# EAGLE design dual uln plane (EAGLE 5.10)
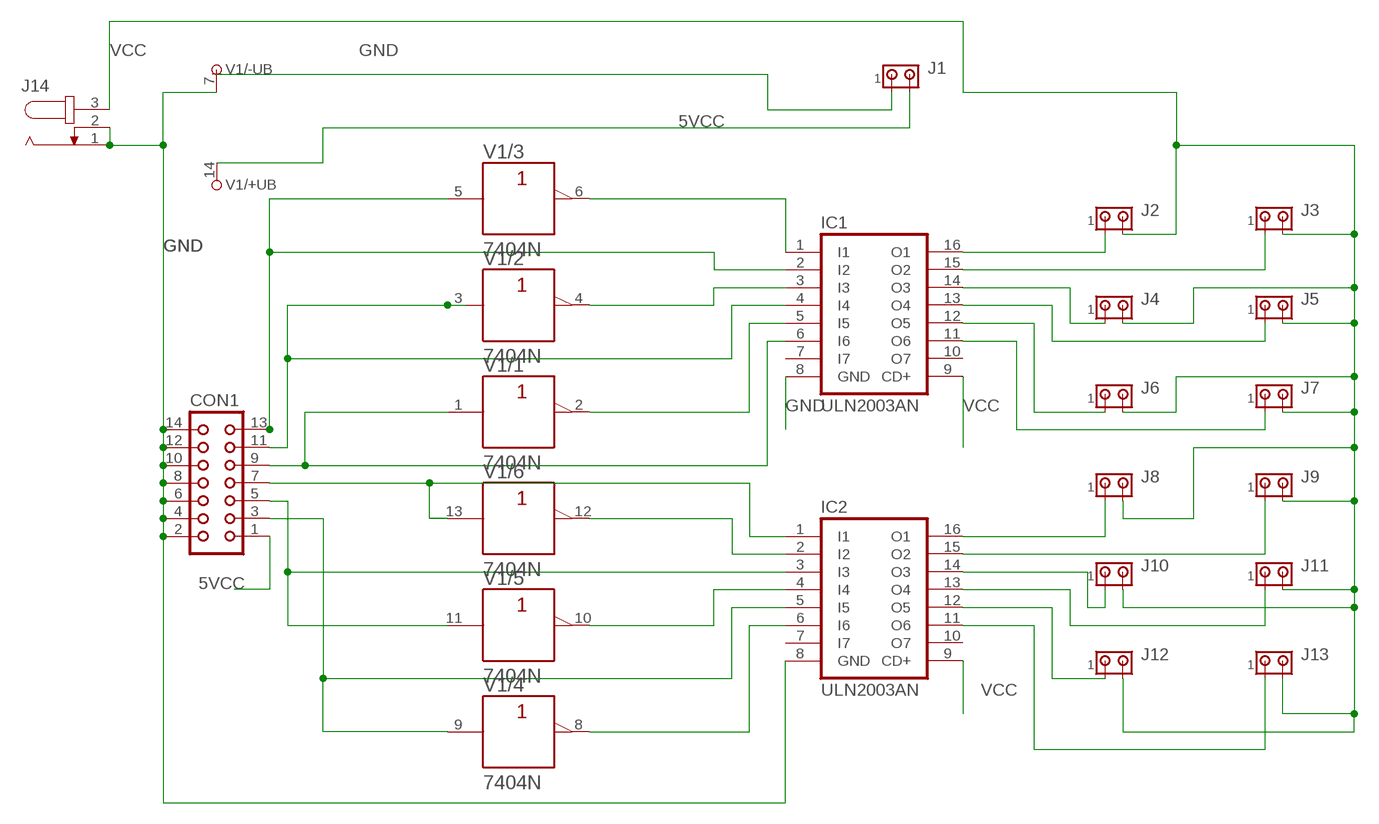
[diagram p0: schematic, sheet 1]

## Parts
CON1  CON14  [CON14]
IC1  ULN2003AN  [DIL16]
IC2  ULN2003AN  [DIL16]
J1  MTA02-100  [10X02MTA]
J2  MTA02-100  [10X02MTA]
J3  MTA02-100  [10X02MTA]
J4  MTA02-100  [10X02MTA]
J5  MTA02-100  [10X02MTA]
J6  MTA02-100  [10X02MTA]
J7  MTA02-100  [10X02MTA]
J8  MTA02-100  [10X02MTA]
J9  MTA02-100  [10X02MTA]
J10  MTA02-100  [10X02MTA]
J11  MTA02-100  [10X02MTA]
J12  MTA02-100  [10X02MTA]
J13  MTA02-100  [10X02MTA]
J14  JACK-PLUG1  [SPC4078]
V1  7404N  [DIL14]

## Nets
5VCC: CON1.1 J1.2 V1.14(/+UB:+UB)
GND: CON1.2 CON1.4 CON1.6 CON1.8 CON1.10 CON1.12 CON1.14 IC1.8(GND) IC2.8(GND) J1.1 J14.1 J14.2 V1.7(/-UB:-UB)
N$1: IC1.3(I3) V1.4(/2:Y)
N$2: IC1.5(I5) V1.2(/1:Y)
N$3: CON1.13 IC1.2(I2) V1.5(/3:A)
N$4: CON1.7 IC2.1(I1) V1.13(/6:A)
N$5: CON1.11 IC1.4(I4) V1.3(/2:A)
N$6: IC1.1(I1) V1.6(/3:Y)
N$7: CON1.9 IC1.6(I6) V1.1(/1:A)
N$9: CON1.5 IC2.3(I3) V1.11(/5:A)
N$10: CON1.3 IC2.5(I5) V1.9(/4:A)
N$12: IC2.2(I2) V1.12(/6:Y)
N$13: IC2.4(I4) V1.10(/5:Y)
N$14: IC2.6(I6) V1.8(/4:Y)
N$15: IC1.16(O1) J2.1
N$16: IC1.15(O2) J3.1
N$17: IC1.14(O3) J4.1
N$18: IC1.13(O4) J5.1
N$19: IC1.12(O5) J6.1
N$20: IC1.11(O6) J7.1
N$21: IC2.16(O1) J8.1
N$22: IC2.15(O2) J9.1
N$23: IC2.14(O3) J10.1
N$24: IC2.13(O4) J11.1
N$25: IC2.12(O5) J12.1
N$26: IC2.11(O6) J13.1
VCC: IC1.9(CD+) IC2.9(CD+) J2.2 J3.2 J4.2 J5.2 J6.2 J7.2 J8.2 J9.2 J10.2 J11.2 J12.2 J13.2 J14.3
Unconnected: IC1.7(I7) IC1.10(O7) IC2.7(I7) IC2.10(O7)

## Library data of the parts
CON1 = con-harting:CON14: CONNECTOR
IC1 IC2 = uln-udn:ULN2003A: DRIVER ARRAY
J1-J13 = con-amp:MTA02-100: AMP connector
J14 = con-jack:JACK-PLUG: DC POWER JACK Power Jack, DC, Right Angle, Through Hole, Rated 5A at 16VDC, PC Terminals Distributor: Farnell (www.Farnell.de) Drawing: 84N1161.pdf / 84N1162.pdf Manufacturer: SPC Technology (www.spctechnology.com) Type: SPC4077 / SPC 4078
V1 = 74ttl-din:74*04: Hex INVERTER

## Board
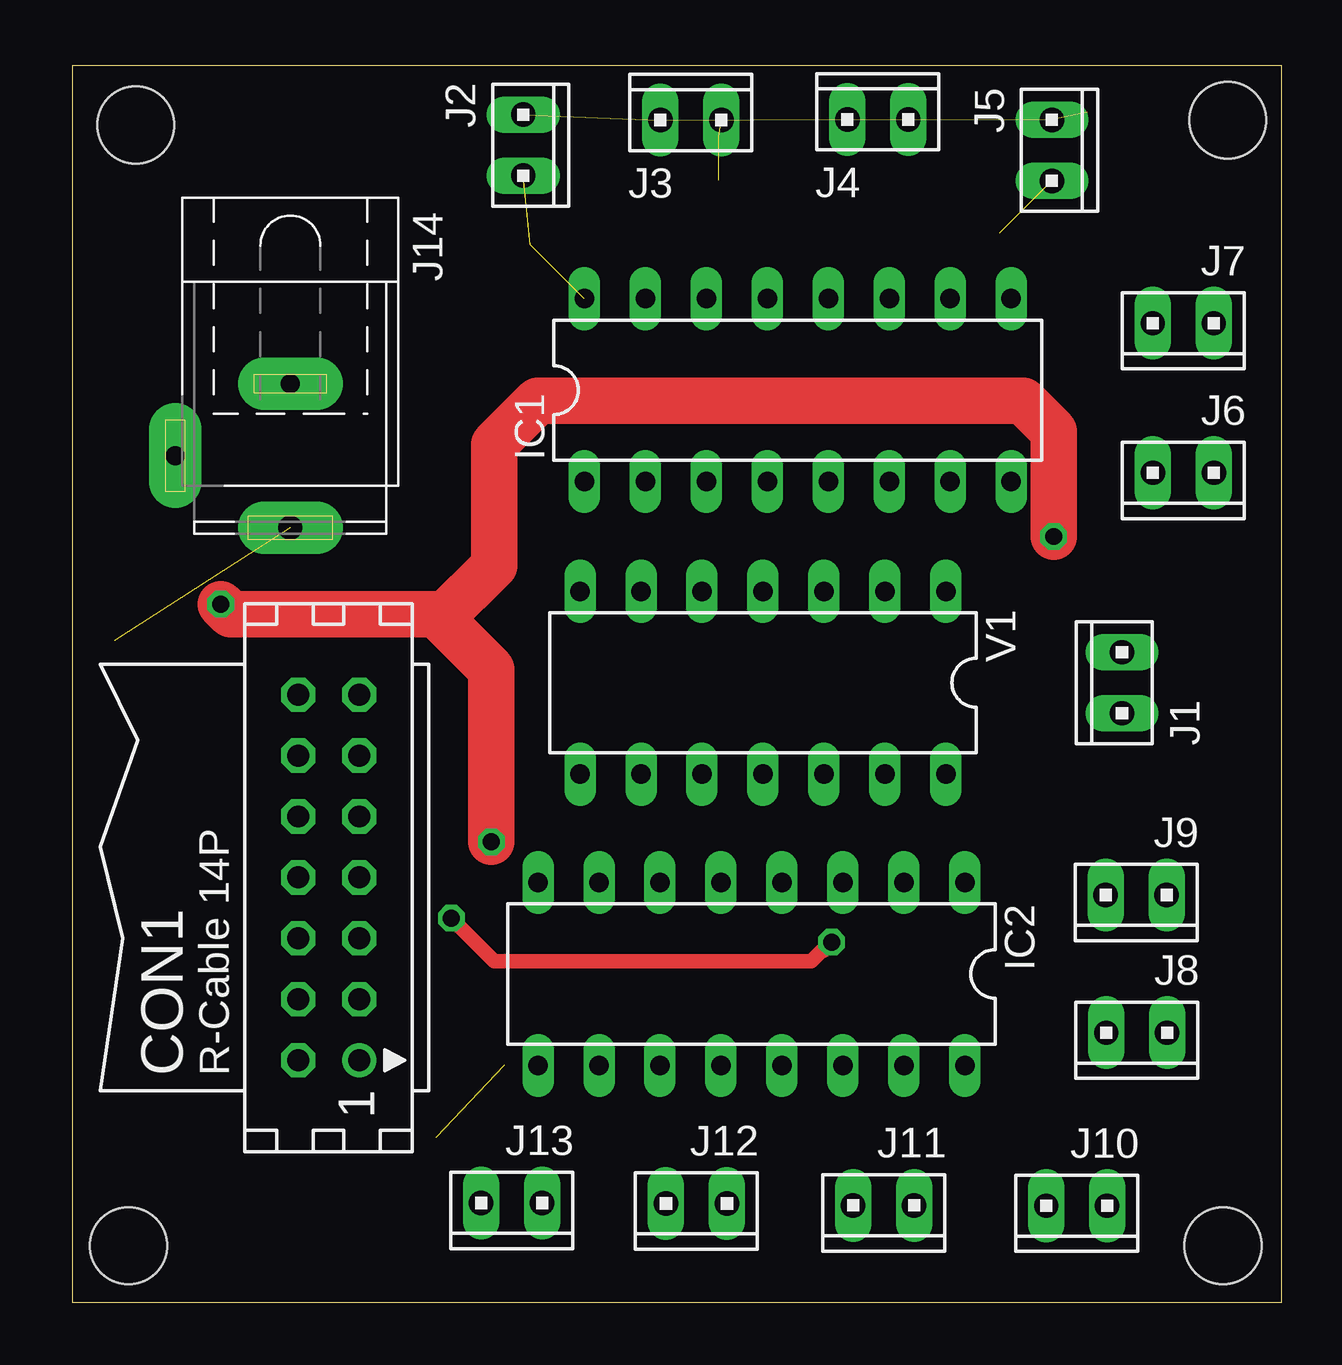
[diagram p1: board, top side]
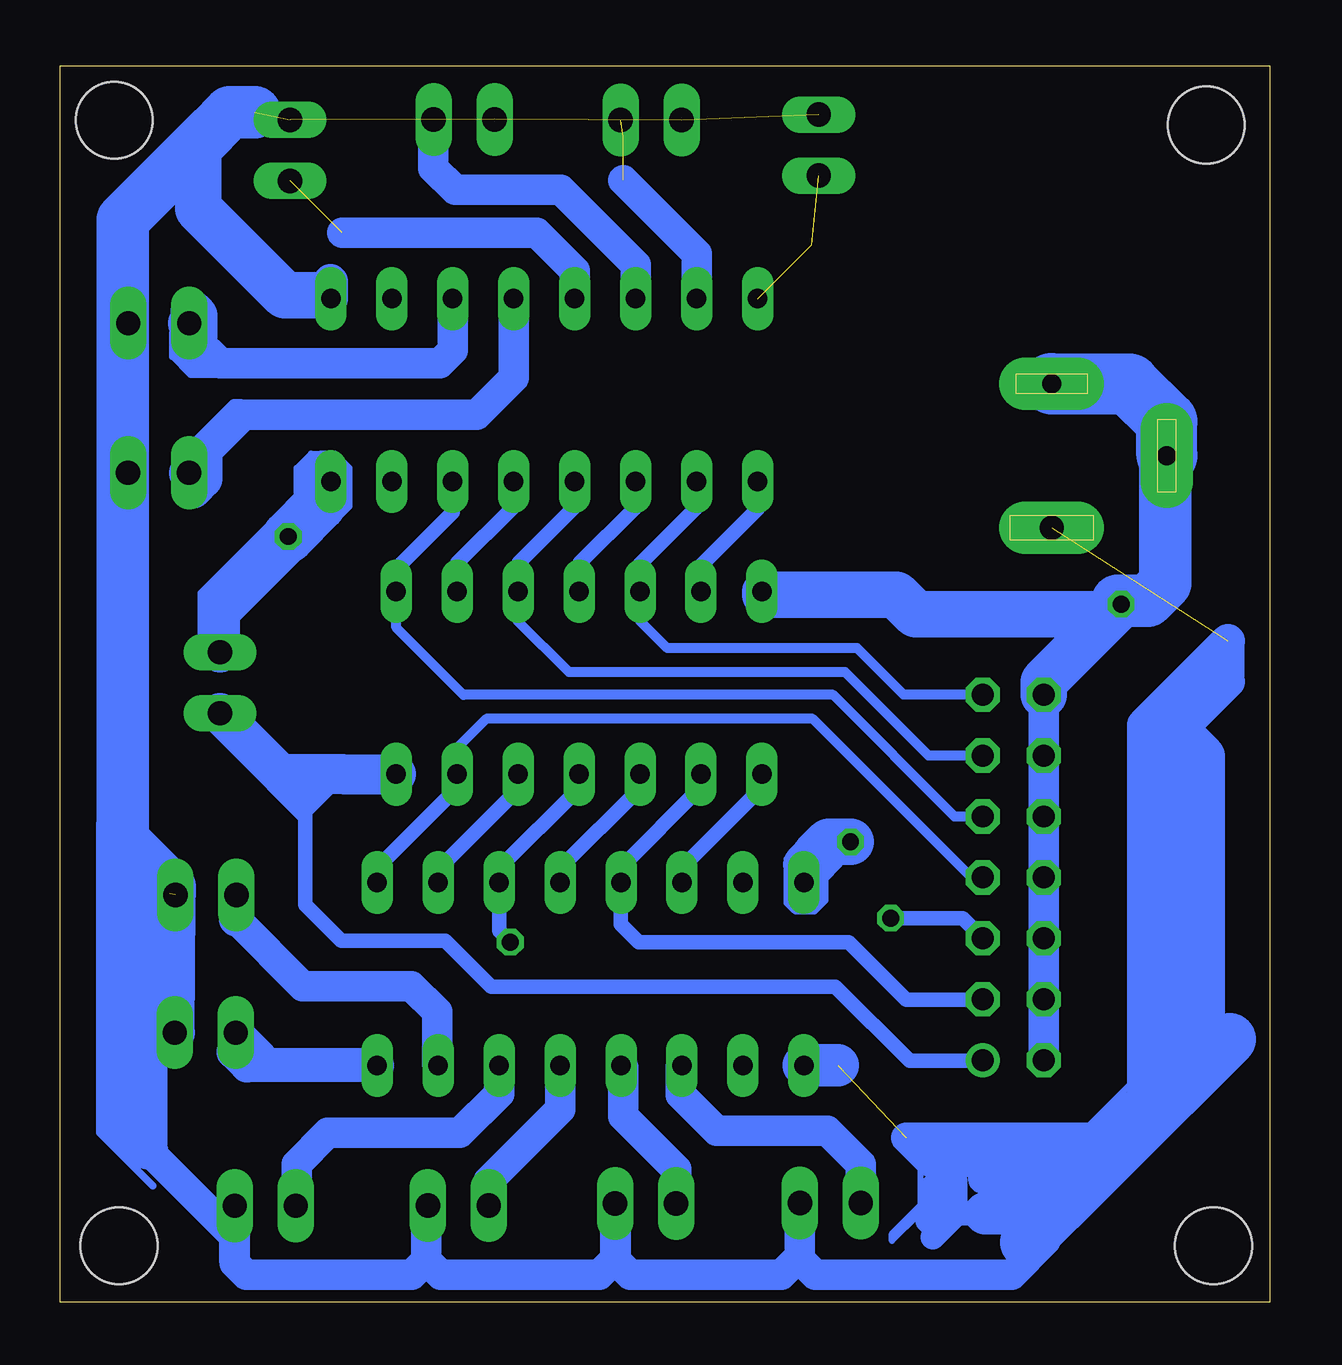
[diagram p2: board, bottom side, seen from below]

Size 50.41 x 51.52 mm. Coordinates in mm from the lower left corner, seen from the top.
Outline: 0,0 50.41,0 50.41,51.52 0,51.52 0,0
Copper layers (1*16): Top 0.035mm / dielectric 1.5mm / Bottom 0.035mm
Design rules "default *": minimum track width 10mil, minimum drill 24mil, track to track 50mil, track to pad 80mil, pad to pad 80mil, via to via 80mil, smd to smd 98mil, copper to edge 40mil, drill to drill 8mil, minimum pad ring 10mil, minimum via ring 8mil, stop-mask expansion 4mil, vias tented up to drill 0mil, thermal gap 10mil
Holes 3.2 mm at 2.65,49.06 2.35,2.36 47.95,2.36 48.15,49.26

### Footprints (pad centres in the part's own frame; a part is rotated, then mirrored left to right if it is on the bottom)
CON14 = drill 0.914 round: 1 -7.62,-1.27 | drill 0.914 octagon: 2 -7.62,1.27; 3 -5.08,-1.27; 4 -5.08,1.27; 5 -2.54,-1.27; 6 -2.54,1.27; 7 0,-1.27; 8 0,1.27; 9 2.54,-1.27; 10 2.54,1.27; 11 5.08,-1.27; 12 5.08,1.27; 13 7.62,-1.27; 14 7.62,1.27
DIL16 = drill 0.813 long: 1 -8.89,-3.81; 2 -6.35,-3.81; 3 -3.81,-3.81; 4 -1.27,-3.81; 5 1.27,-3.81; 6 3.81,-3.81; 7 6.35,-3.81; 8 8.89,-3.81; 9 8.89,3.81; 10 6.35,3.81; 11 3.81,3.81; 12 1.27,3.81; 13 -1.27,3.81; 14 -3.81,3.81; 15 -6.35,3.81; 16 -8.89,3.81
10X02MTA = drill 1.016 long: 1 1.27,0; 2 -1.27,0
SPC4078 = drill 0.8 pad 2.184 long: 1 -3,0; 2 0,-4.8 | drill 1 pad 2.184 long: 3 3,0
DIL14 = drill 0.813 long: 1 -7.62,-3.81; 2 -5.08,-3.81; 3 -2.54,-3.81; 4 0,-3.81; 5 2.54,-3.81; 6 5.08,-3.81; 7 7.62,-3.81; 8 7.62,3.81; 9 5.08,3.81; 10 2.54,3.81; 11 0,3.81; 12 -2.54,3.81; 13 -5.08,3.81; 14 -7.62,3.81

### Placement (x,y rotation side)
CON1  10.69,17.71 90 top
IC1  30.24,38.01 0 top
IC2  28.31,13.69 180 top
J1  43.75,25.82 90 top
J2  18.8,48.22 270 top
J3  25.78,49.27 0 top
J4  33.57,49.29 0 top
J5  40.83,48 270 top
J6  46.3,34.57 180 top
J7  46.3,40.8 180 top
J8  44.36,11.24 180 top
J9  44.34,16.98 180 top
J10  41.86,4.03 180 top
J11  33.82,4.05 180 top
J12  26.02,4.12 180 top
J13  18.32,4.14 180 top
J14  9.1,35.28 270 top
V1  28.79,25.82 180 top

### Tracks (layer width: path | path; a pad name or v marks a point on that pad's centre or on a via)
5VCC
  Bottom 0.305: 41.25,21.31 40.35,20.41 40.2,20.41 | 40.15,20.51 40.18,20.49 | 40.2,20.01 41.65,21.46
  Bottom 0.61: 38.65,22.01 40.18,20.49 40.2,20.46 40.2,20.41 40.2,20.01 40.2,16.56 38.7,15.06 34.35,15.06 32.45,13.16 18.1,13.16 15,10.06 11.99,10.06 CON1.1 | 40.85,21.56 40.85,21.21 40.15,20.51 40.15,21.01 40.2,21.06 40.7,21.06 41,21.36
  Bottom 1.676: V1.14 38.65,22.01 41.21,22.01 J1.2
GND  (via drill 0.7)
  Top 1.93: v6.2,29.09 6.62,28.67 15.18,28.67 15.37,28.48 | v40.9,31.91 40.9,36.3 39.63,37.57 19.4,37.57 17.58,35.75 17.58,30.69 15.37,28.48 | v17.47,19.19 17.47,26.38 15.37,28.48
  Bottom 0.254: 38.45,34.36 38.45,34.06 38.35,33.96 | 38.45,34.86 38.45,33.26 38.85,32.86 38.85,32.66 38.35,33.16 38.35,33.96 | 38.45,34.86 38.35,34.76 38.35,33.96 | 38.85,35.26 38.45,34.86 | 38.85,35.26 39.45,35.26 39.55,35.36 39.05,35.36 38.85,35.16 38.85,35.26 | 38.85,35.26 38.95,35.36 39.95,35.36 40.55,34.76 40.55,33.56 44.55,29.56 44.55,27.66 | 44.55,27.56 44.55,27.66 | 44.55,27.56 44.35,27.36 44.15,27.36 | 44.15,27.36 40.45,31.06 41.15,31.06 44.55,27.66 | 44.55,27.56 44.55,27.06 44.25,26.76 | 44.15,27.36 44.02,27.36 J1.1
  Bottom 0.406: 18.6,17.31 18.6,16.76 19,16.36 19.75,16.36 20.05,16.66 20.05,18.46 19.7,18.81 | 18.6,17.31 18.6,17.76 18.65,17.76 18.8,17.91 | 18.6,17.31 19.3,17.31 19.75,16.86 19.7,16.86 19.5,16.66 19.3,16.66 19.2,16.76 19.05,16.76 18.85,16.96
  Bottom 1.016: 19.46,17.75 18.96,17.75 18.8,17.91 18.23,18.48 18.23,18.5 18.65,18.92
  Bottom 1.27: CON1.2 CON1.4 CON1.6 CON1.8 CON1.10 CON1.12 CON1.14 | 19.46,17.75 IC2.8 | v6.2,29.09 6.33,29.23
  Bottom 1.676: 19.46,18.25 19.09,18.62 18.94,18.62 | 21.03,29.49 V1.7 | J1.1 43.75,29.07 v40.9,31.91
  Bottom 1.778: IC1.8 39.58,34.2
  Bottom 1.93: 18.94,18.62 18.65,18.92 18.37,19.19 v17.47,19.19 | 21.03,29.49 15.57,29.49 14.75,28.67 6.62,28.67 v6.2,29.09 9.42,25.87 CON1.14
  Bottom 2.184: 39.58,34.2 39.58,33.23 v40.9,31.91 | 6.33,29.23 5.09,29.23 4.35,29.96 4.35,35.23 J14.2
  Bottom 2.54: J14.2 4.3,36.71 5.85,38.26 9.08,38.26 J14.1
N$1
  Bottom 0.61: IC1.3 26.43,33.14 28.75,30.81 28.75,29.66 V1.4
N$2
  Bottom 0.61: IC1.5 31.51,33.16 33.85,30.81 33.85,29.64 V1.2
N$3
  Bottom 0.406: V1.5 26.25,28.41 25.1,27.26 17.2,27.26 15.27,25.33 CON1.13
  Bottom 0.61: IC1.2 23.89,33.13 26.25,30.76 V1.5
N$4
  Bottom 0.254: 33.9,22.05 V1.13
  Bottom 0.406: CON1.7 12.45,17.71 19.05,24.31 32.65,24.31 33.9,23.06 33.9,22.05
  Bottom 0.61: IC2.1 37.2,18.11 33.87,21.45 V1.13
N$5
  Bottom 0.406: CON1.11 14.23,22.79 17.7,26.26 29.2,26.26 31.35,28.41 31.35,29.6 V1.3
  Bottom 0.61: IC1.4 28.97,33.15 31.3,30.81 31.3,29.65 V1.3
N$6
  Bottom 0.61: IC1.1 21.35,33.07 23.65,30.76 23.65,29.68 V1.6
N$7
  Bottom 0.406: CON1.9 13.14,20.25 18.2,25.31 33.6,25.31 36.4,28.11 V1.1
  Bottom 0.61: IC1.6 34.05,32.92 36.4,30.56 V1.1
N$9  (via drill 0.7)
  Top 0.61: v31.65,15.01 31.3,14.66 31.24,14.66 30.79,14.22 17.6,14.22 v15.8,16.01
  Bottom 0.61: V1.11 28.79,21.43 32.15,18.06 32.15,17.53 IC2.3 32.12,15.48 v31.65,15.01 | CON1.5 12.81,16.01 v15.8,16.01
N$10
  Bottom 0.406: 27.05,17.48 IC2.5
  Bottom 0.61: IC2.5 27.05,17.51 27.05,18.11 23.71,21.46 V1.9 | 27.05,17.48 27.05,15.76 26.3,15.01 17.55,15.01 15.15,12.61 11.98,12.61 CON1.3
N$12
  Bottom 0.61: V1.12 31.33,21.39 34.7,18.01 34.7,17.54 IC2.2
N$13
  Bottom 0.61: V1.10 26.25,21.42 29.6,18.06 29.6,17.52 IC2.4
N$14
  Bottom 0.61: V1.8 21.17,21.45 24.5,18.11 IC2.6
N$15  (2 unrouted)
N$16  (2 unrouted)
  Bottom 1.27: IC1.15 23.89,43.7 26.95,46.76
N$17
  Bottom 1.27: IC1.14 26.43,43.24 29.55,46.36 33.95,46.36 34.85,47.26 34.85,48.98 J4.1
N$18  (1 unrouted)
  Bottom 1.27: IC1.13 28.97,42.98 30.55,44.56 38.66,44.56
N$19
  Bottom 0.254: 45.24,35.49 43.25,37.48 43.24,37.48 43.23,37.49 42.83,37.49 | 42.83,37.49 42.82,37.5 43.22,37.5 43.26,37.46 | 42.83,37.49 42.83,37.07 42.75,36.99
  Bottom 1.27: IC1.12 31.51,38.54 33.05,36.99 42.75,36.99 44.48,35.26
  Bottom 1.676: 44.48,35.26 44.48,34.33 44.9,33.91 44.9,34.44 J6.1
N$20
  Bottom 0.254: 44.79,38.9 45.52,39.63 45.52,39.68 45.13,39.29 45.09,39.29 44.99,39.19 44.79,39.19 44.38,38.78 44.31,38.78 44.34,38.81 44.85,38.81 45.65,39.61 45.65,40.49 45.74,40.4 45.74,39.39 44.98,38.63 43.74,38.63 43.74,39.14 43.81,39.21
  Bottom 1.27: IC1.11 34.05,39.68 34.59,39.13 43.73,39.13 43.81,39.21 44.73,40.13
  Bottom 1.778: 44.73,40.13 44.73,41.1 44.93,41.3 44.93,40.9 J7.1
N$21
  Bottom 1.422: J8.1 42.11,10.26 42.11,10.15 42.4,10.44 43.18,10.44 42.62,9.88 IC2.16
N$22
  Bottom 1.27: 43.07,15.96 40.29,13.18 35.77,13.18 34.7,12.11 34.7,9.92 IC2.15 | J9.1
  Bottom 1.422: 43.07,15.96 J9.1
N$23
  Bottom 1.27: IC2.14 32.12,8.7 33.75,7.06 39.25,7.06 40.55,5.76 40.55,4.07 J10.1
N$24
  Bottom 1.27: IC2.13 29.58,8.04 32.55,5.06 J11.1
N$25
  Bottom 1.27: J12.1 24.75,5.56 26.95,7.76 26.95,9.79 IC2.12
N$26
  Bottom 1.27: J13.1 17.05,5.76 18.45,7.16 23.05,7.16 24.55,8.66 24.55,9.82 IC2.11
NCC
  Bottom 0.254: 14.45,5.66 14.55,5.56 14.55,4.06 15.75,2.86 15.75,2.56 14.65,3.66 13.85,3.66
  Bottom 1.27: 13.85,3.66 13.95,3.76 13.95,3.96 | 13.95,3.96 13.95,4.76 | 13.95,3.96 13.85,3.86 13.85,3.46 14.15,3.46
VCC  (7 unrouted)
  Bottom 0.254: 47.75,18.96 47.43,18.96 47.43,18.89 | 5.25,7.96 5.35,7.96 5.35,7.46 | 5.25,9.66 7.65,7.26 7.65,6.06 6.05,7.66 6.05,8.66 7.05,7.66 7.05,7.46 7.15,7.46 7.05,7.56 6.65,7.56 6.15,8.06 6.15,8.26 6.25,8.16 | 6.25,8.16 6.75,7.66 6.85,7.66 6.35,8.16 6.25,8.16
  Bottom 0.305: 47.05,44.16 47.8,44.16 47.8,44.36 | 46.55,4.86 48.75,7.06 48.75,19.96 47.75,18.96 47.75,18.16
  Bottom 1.016: 13.1,3.66 13.1,5.06 | 13.1,3.66 14.05,2.71 | 11.85,3.71 13.05,3.71 13.1,3.66
  Bottom 1.27: 5.35,7.46 5.95,6.86 15.15,6.86 14.15,5.86 7.95,5.86 8.65,5.16 11.95,5.16 | 9.73,2.94 9.35,2.56 10.75,1.16 18.95,1.16 19.59,1.8 J13.2 19.59,1.93 20.35,1.16 26.65,1.16 27.25,1.76 27.25,4.09 J12.2 27.29,1.83 27.95,1.16 34.55,1.16 35.15,1.76 | 35.15,1.76 35.15,3.98 J11.2 | 35.15,1.76 35.75,1.16 42.65,1.16 43.13,1.64 J10.2 43.13,1.79 43.15,1.76 43.15,2.76 46.75,6.36
  Bottom 1.422: 45.73,16.5 45.89,16.5 45.92,16.53 | 45.95,11.6 45.95,11.35 J9.2 | 47.5,45.01 46.49,46.01 | 47.5,45.01 47.57,44.93 | 47.8,45.11 47.7,45.01 47.5,45.01 | 5.25,7.96 5.25,9.66 5.25,24.06 1.75,27.56 1.75,25.86 3.75,23.86 | 1.68,10.96 2.75,10.96 2.75,11.56 | IC1.9 39.13,42.54 39.15,42.56 39.15,42.26 39.45,41.96
  Bottom 1.676: J8.2 45.6,16.64 45.73,16.5 | 47.8,43.75 47.57,43.52 J7.2 J6.2 | 47.75,18.16 46.75,17.16 46.75,6.36 47.85,7.46 47.85,7.76 47.95,7.86 47.95,18.96 47.45,18.46 47.45,7.46
  Bottom 1.778: IC2.9 18.02,9.88 | 11.85,3.71 8.95,3.71 7.63,5.04 | 3.75,23.86 3.75,23.76 2.75,22.76 2.75,11.56 4.25,10.06 4.25,14.06 3.75,14.56 3.75,22.66 4.25,23.16
  Bottom 1.93: 7.88,4.78 8.56,4.1 | 39.45,41.96 41.05,41.96 44.65,45.56 44.65,48.26 44.05,48.86
  Bottom 2.184: 45.92,16.53 45.92,11.63 45.95,11.6 | 10.16,2.5 9.73,2.94 7.88,4.78 7.63,5.04 6.39,6.27 6.37,6.27 1.68,10.96 | 42.3,49.58 43.33,49.58 44.05,48.86 47.8,45.11 47.8,44.36 47.8,43.75 47.8,19.26 47.43,18.89 45.84,17.3 45.84,17.02 45.87,16.99